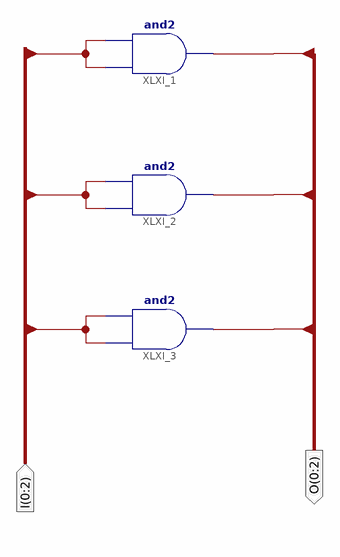
[diagram p0: schematic sheet 1]
// Xilinx ISE schematic ConnectorIO.sch (spartan3e) as structural Verilog: 3 symbols, 2 ports
module ConnectorIO (
  input  [0:2] I,
  output [0:2] O
);

  and XLXI_1 (O[0], I[0], I[0]);
  and XLXI_2 (O[1], I[1], I[1]);
  and XLXI_3 (O[2], I[2], I[2]);
endmodule
